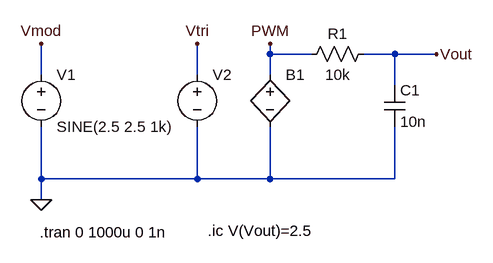
[diagram p0: schematic SineModulatedPWM.asc]
SineModulatedPWM.asc, the LTspice schematic file:
Version 4
SHEET 1 880 680
WIRE 304 96 304 80
WIRE 368 96 304 96
WIRE 496 96 448 96
WIRE 560 96 496 96
WIRE -48 128 -48 80
WIRE 192 128 192 80
WIRE 304 128 304 96
WIRE 496 144 496 96
WIRE -48 288 -48 208
WIRE 192 288 192 208
WIRE 192 288 -48 288
WIRE 304 288 304 208
WIRE 304 288 192 288
WIRE 496 288 496 208
WIRE 496 288 304 288
WIRE -48 320 -48 288
FLAG 192 80 Vtri
FLAG -48 80 Vmod
FLAG 304 80 PWM
FLAG -48 320 0
FLAG 560 96 Vout
SYMBOL voltage -48 112 R0
WINDOW 123 0 0 Left 2
WINDOW 39 0 0 Left 2
SYMATTR InstName V1
SYMATTR Value SINE(2.5 2.5 1k)
SYMBOL voltage 192 112 R0
WINDOW 3 24 96 Invisible 2
WINDOW 123 0 0 Left 2
WINDOW 39 0 0 Left 2
SYMATTR InstName V2
SYMATTR Value PULSE(0 5 0 16e-6 1n 0 16.001e-6)
SYMBOL bv 304 112 R0
WINDOW 3 24 96 Invisible 2
SYMATTR InstName B1
SYMATTR Value V=IF(V(Vmod)>V(Vtri),5,0)
SYMBOL cap 480 144 R0
SYMATTR InstName C1
SYMATTR Value 10n
SYMBOL res 464 80 R90
WINDOW 0 0 56 VBottom 2
WINDOW 3 32 56 VTop 2
SYMATTR InstName R1
SYMATTR Value 10k
TEXT -50 370 Left 2 !.tran 0 1000u 0 1n
TEXT 208 368 Left 2 !.ic V(Vout)=2.5

The netlist it stands for:
* SineModulatedPWM.asc
V1 Vmod 0 SINE(2.5 2.5 1k)
V2 Vtri 0 PULSE(0 5 0 16e-6 1n 0 16.001e-6)
B1 PWM 0 V=IF(V(Vmod)>V(Vtri),5,0)
C1 Vout 0 10n
R1 Vout PWM 10k
.tran 0 1000u 0 1n
.ic V(Vout)=2.5
.backanno
.end